# Altium schematic sheet HDMI8x8_CoverSheet.SchDoc
size A4; Date: Not shown in title block; ApprovedBy: Not shown in title block; CheckedBy: Not shown in title block; Author: Not shown in title block; CompanyName: Not shown in title block; Engineer: Not shown in title block; Organization: Not shown in title block; Address1: Not shown in title block; Address2: Not shown in title block; Address3: Not shown in title block; Address4: Not shown in title block; DocumentNumber: 1; Revision: Use project parameter SCH_Rev; SheetNumber: 1; SheetTotal: 3; PageSetup: Record=PageOptions|CenterHorizontal=True|CenterVertical=True|PrintScale=1.00|XCorrection=1.00|YCorrection=1.00|PrintKind=0|BorderSize=5000000|LeftOffset=0|BottomOffset=0|Orientation=2|PaperLength=1000|PaperWidth=1000|Scale=100|PaperSource=15|PrintQuality=600|MediaType=1|DitherType=10|PaperKind=Letter|PrintScaleMode=1; CurrentTime: Not shown in title block; CurrentDate: Not shown in title block; Time: Not shown in title block; DocumentFullPathAndName: Not shown in title block; DocumentName: Not shown in title block; ModifiedDate: Not shown in title block; ImagePath: Not shown in title block
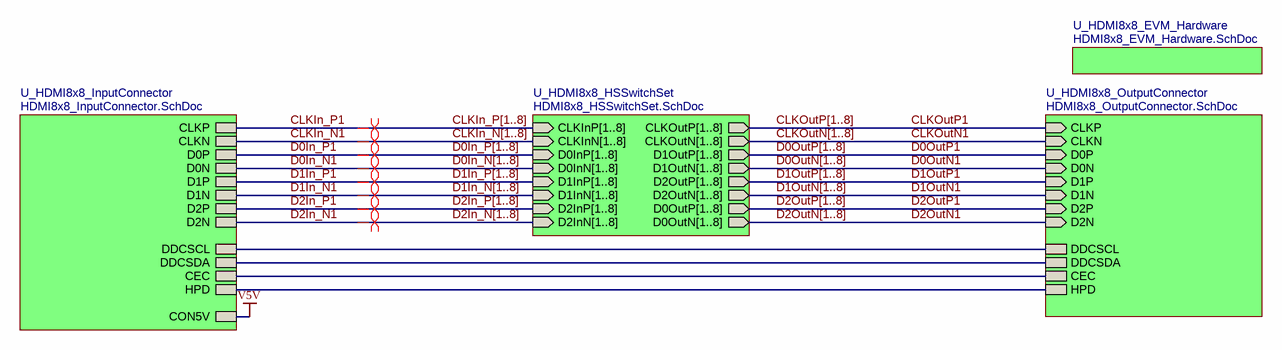
[diagram p0: HDMI8x8_CoverSheet.SchDoc]

## Sub-sheets
U_HDMI8x8_EVM_Hardware = HDMI8x8_EVM_Hardware.SchDoc: no entries
U_HDMI8x8_HSSwitchSet = HDMI8x8_HSSwitchSet.SchDoc: CLKInP[1..8] (in), CLKInN[1..8] (in), CLKOutP[1..8] (out), CLKOutN[1..8] (out), D1InP[1..8] (in), D1InN[1..8] (in), D1OutP[1..8] (out), D1OutN[1..8] (out), D2InP[1..8] (in), D2InN[1..8] (in), D2OutP[1..8] (out), D2OutN[1..8] (out), D0InP[1..8] (in), D0InN[1..8] (in), D0OutP[1..8] (out), D0OutN[1..8] (out)
U_HDMI8x8_InputConnector = HDMI8x8_InputConnector.SchDoc: D2P, D2N, D1P, D1N, D0P, D0N, CLKP, CLKN, CEC, DDCSCL, DDCSDA, CON5V, HPD
U_HDMI8x8_OutputConnector = HDMI8x8_OutputConnector.SchDoc: D2P (in), D2N (in), D1P (in), D1N (in), D0P (in), D0N (in), CLKP (in), CLKN (in), CEC, DDCSCL, DDCSDA, HPD

## Nets
V5V: sheet U_HDMI8x8_InputConnector/CON5V
CLKIn_N1: sheet U_HDMI8x8_InputConnector/CLKN
CLKIn_P1: sheet U_HDMI8x8_InputConnector/CLKP
CLKOutN1: sheet U_HDMI8x8_OutputConnector/CLKN
CLKOutP1: sheet U_HDMI8x8_OutputConnector/CLKP
D0In_N1: sheet U_HDMI8x8_InputConnector/D0N
D0In_P1: sheet U_HDMI8x8_InputConnector/D0P
D0OutN1: sheet U_HDMI8x8_OutputConnector/D0N
D0OutP1: sheet U_HDMI8x8_OutputConnector/D0P
D1In_N1: sheet U_HDMI8x8_InputConnector/D1N
D1In_P1: sheet U_HDMI8x8_InputConnector/D1P
D1OutN1: sheet U_HDMI8x8_OutputConnector/D1N
D1OutP1: sheet U_HDMI8x8_OutputConnector/D1P
D2In_N1: sheet U_HDMI8x8_InputConnector/D2N
D2In_P1: sheet U_HDMI8x8_InputConnector/D2P
D2OutN1: sheet U_HDMI8x8_OutputConnector/D2N
D2OutP1: sheet U_HDMI8x8_OutputConnector/D2P
(unnamed): sheet U_HDMI8x8_InputConnector/CEC, sheet U_HDMI8x8_OutputConnector/CEC
(unnamed): sheet U_HDMI8x8_InputConnector/DDCSCL, sheet U_HDMI8x8_OutputConnector/DDCSCL
(unnamed): sheet U_HDMI8x8_InputConnector/DDCSDA, sheet U_HDMI8x8_OutputConnector/DDCSDA
(unnamed): sheet U_HDMI8x8_InputConnector/HPD, sheet U_HDMI8x8_OutputConnector/HPD

## Buses and harness runs
bus CLKIn_N[1..8] = sheet U_HDMI8x8_HSSwitchSet/CLKInN[1..8]
bus CLKIn_P[1..8] = sheet U_HDMI8x8_HSSwitchSet/CLKInP[1..8]
bus CLKOutN[1..8] = sheet U_HDMI8x8_HSSwitchSet/CLKOutN[1..8]
bus CLKOutP[1..8] = sheet U_HDMI8x8_HSSwitchSet/CLKOutP[1..8]
bus D0In_N[1..8] = sheet U_HDMI8x8_HSSwitchSet/D0InN[1..8]
bus D0In_P[1..8] = sheet U_HDMI8x8_HSSwitchSet/D0InP[1..8]
bus D0OutN[1..8] = sheet U_HDMI8x8_HSSwitchSet/D1OutN[1..8]
bus D0OutP[1..8] = sheet U_HDMI8x8_HSSwitchSet/D1OutP[1..8]
bus D1In_N[1..8] = sheet U_HDMI8x8_HSSwitchSet/D1InN[1..8]
bus D1In_P[1..8] = sheet U_HDMI8x8_HSSwitchSet/D1InP[1..8]
bus D1OutN[1..8] = sheet U_HDMI8x8_HSSwitchSet/D2OutN[1..8]
bus D1OutP[1..8] = sheet U_HDMI8x8_HSSwitchSet/D2OutP[1..8]
bus D2In_N[1..8] = sheet U_HDMI8x8_HSSwitchSet/D2InN[1..8]
bus D2In_P[1..8] = sheet U_HDMI8x8_HSSwitchSet/D2InP[1..8]
bus D2OutN[1..8] = sheet U_HDMI8x8_HSSwitchSet/D0OutN[1..8]
bus D2OutP[1..8] = sheet U_HDMI8x8_HSSwitchSet/D0OutP[1..8]

## Layout directives
differential pair: CLKIn_N1, CLKIn_P1, D0In_N1, D0In_P1, D1In_N1, D1In_P1, D2In_N1, D2In_P1

## Notes on the sheet
- Drawn By:
- SVN Rev:
- Number:
- TID #:
- Orderable:
- Rev:
- Sheet Title:
- File:
- Project Title:
- Designed for:
- Assembly Variant:
- Mod. Date:
- Sheet:
- Size:
- of
- A4
- http://www.ti.com
- Texas Instruments and/or its licensors do not warrant the accuracy or completeness of this specification or any information contained therein. Texas Instruments and/or its licensors do not warrant that this design will meet the specifications, will be suitable for your application or fit for any particular purpose, or will operate in an implementation. Texas Instruments and/or its licensors do not warrant that the design is production worthy. You should completely validate and test your design implementation to confirm the system functionality for your application.
- Engineer:
- Contact:
- © Texas Instruments